# Altium schematic sheet USBgpib-v3-USBTMC.SchDoc
size Tabloid; SheetNumber: 1; SheetTotal: 1; ENG_APP_DATE: --/--/--; DSN_APP_DATE: --/--/--; CHK_APP_DATE: --/--/--
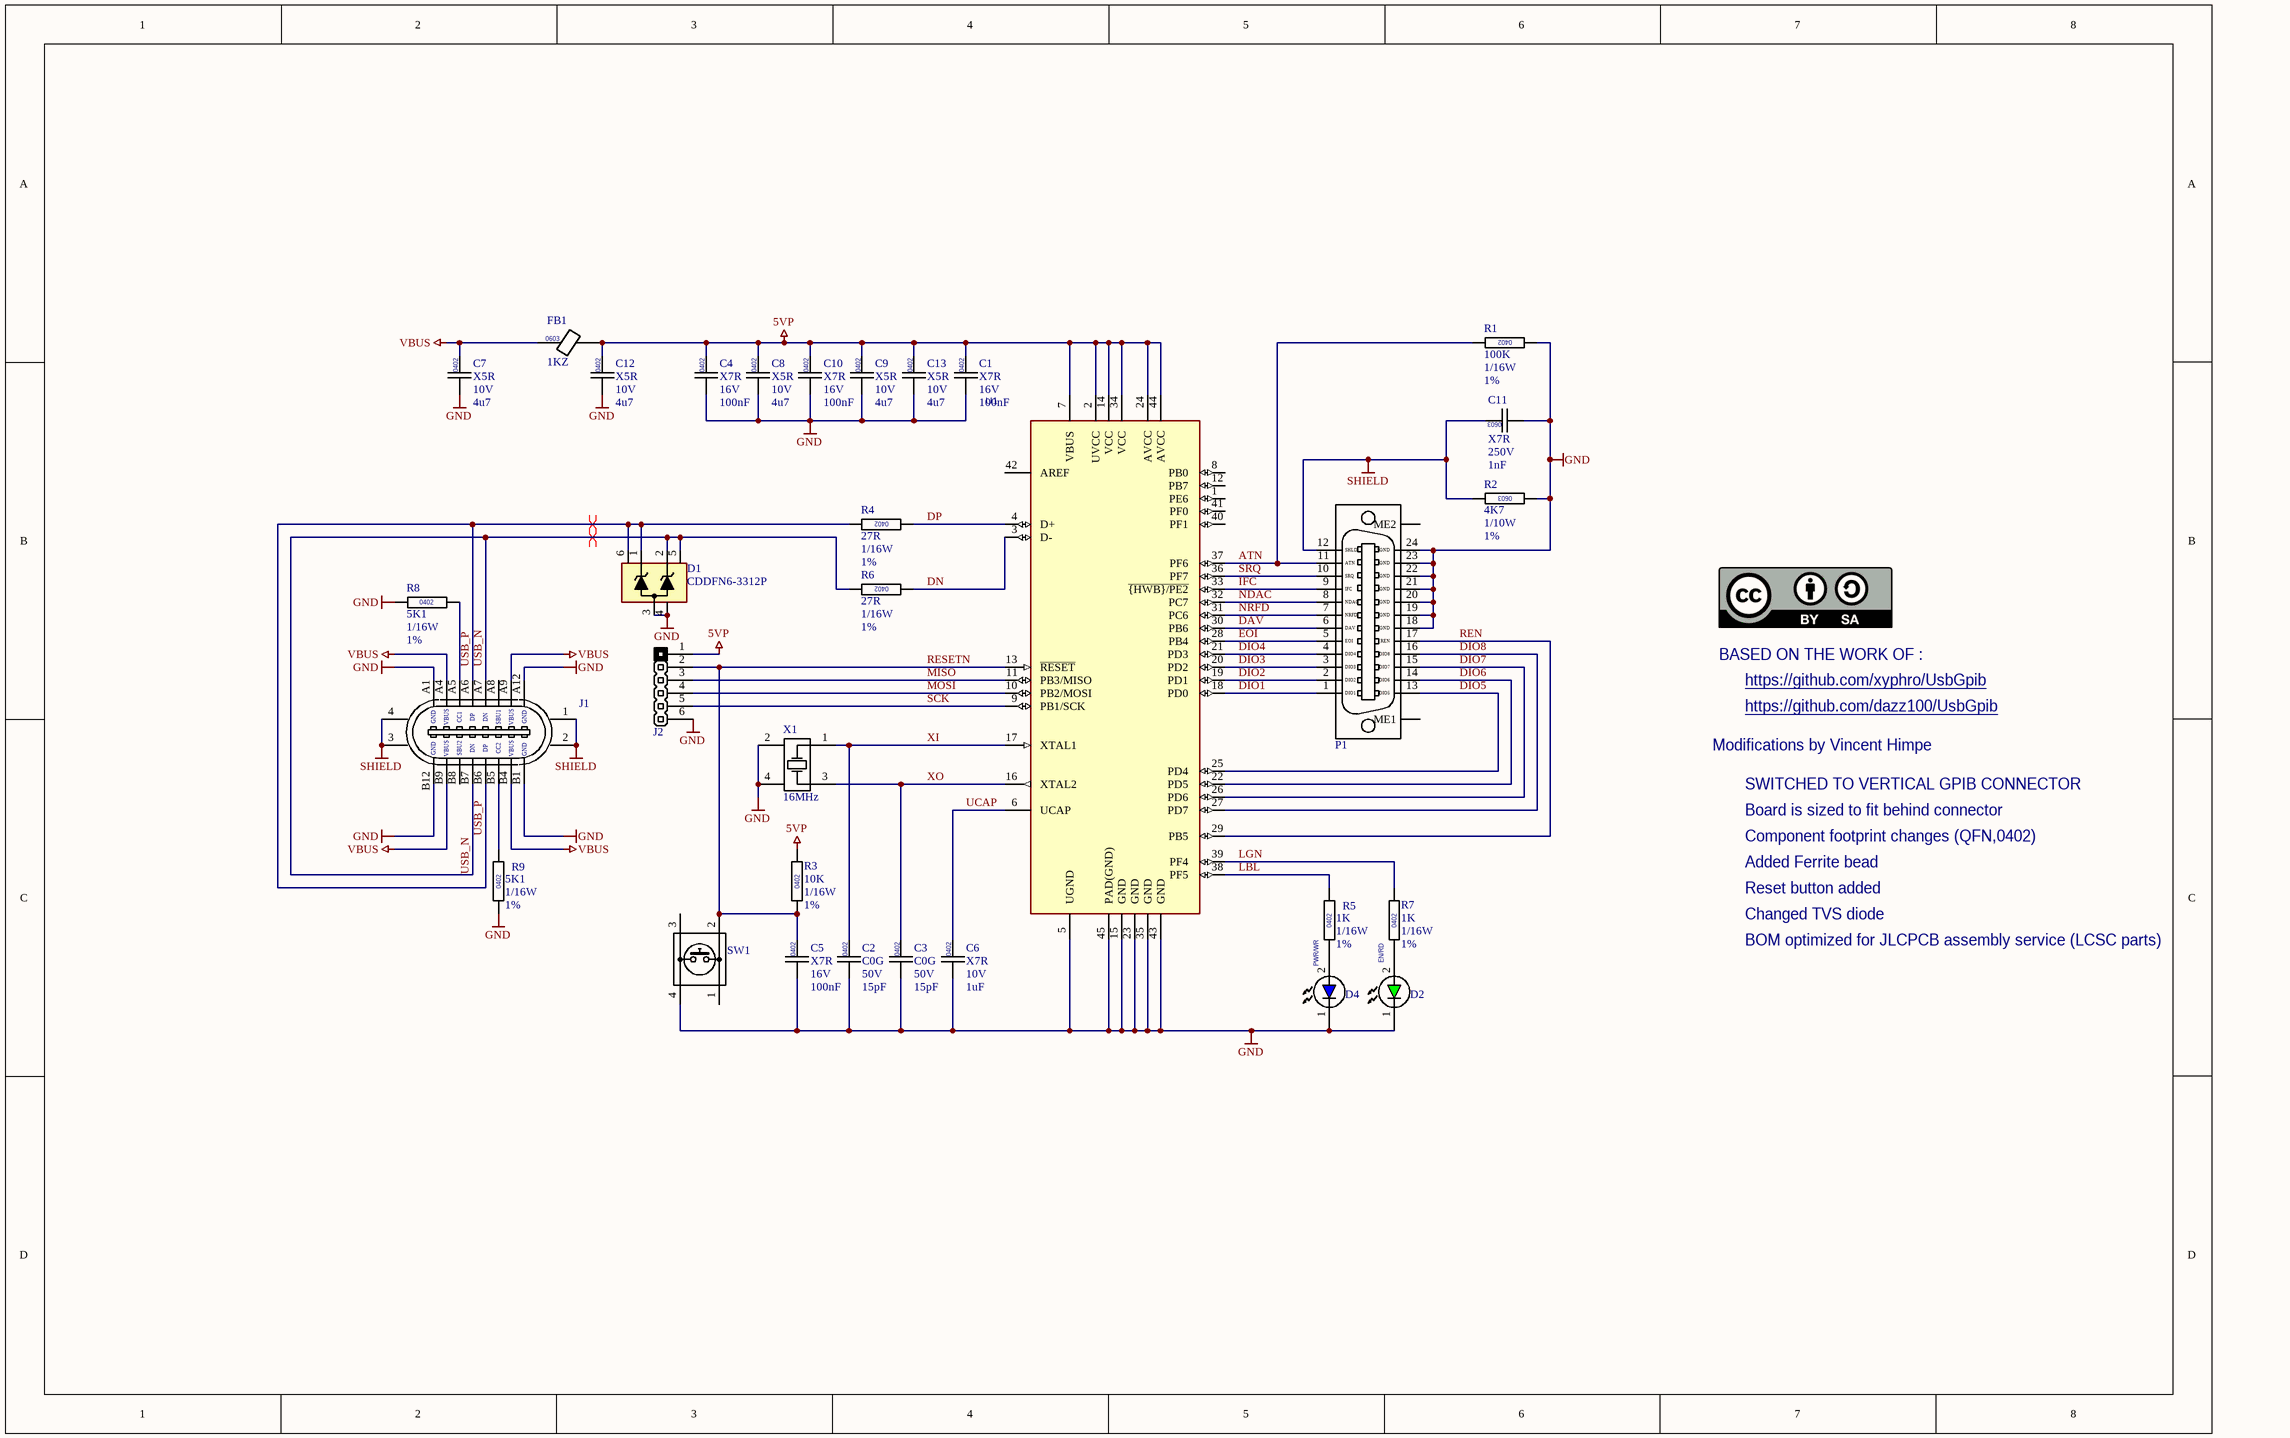
[diagram p0: USBgpib-v3-USBTMC.SchDoc]

## Parts
C1  Dielectric: X7R  Voltage: 16V  Capacitance: 100nF  [CAPC0402]  (hidden comment: CAP0402)
C2  Dielectric: C0G  Voltage: 50V  Capacitance: 15pF  [CAPC0402]  (hidden comment: CAP0603)
C3  Dielectric: C0G  Voltage: 50V  Capacitance: 15pF  [CAPC0402]  (hidden comment: CAP0603)
C4  Dielectric: X7R  Voltage: 16V  Capacitance: 100nF  [CAPC0402]  (hidden comment: CAP0402)
C5  Dielectric: X7R  Voltage: 16V  Capacitance: 100nF  [CAPC0402]  (hidden comment: CAP0402)
C6  Dielectric: X7R  Voltage: 10V  Capacitance: 1uF  [CAPC0402]  (hidden comment: CAP0402)
C7  Dielectric: X5R  Voltage: 10V  Capacitance: 4u7  [CAPC0402]  (hidden comment: CAP0402)
C8  Dielectric: X5R  Voltage: 10V  Capacitance: 4u7  [CAPC0402]  (hidden comment: CAP0402)
C9  Dielectric: X5R  Voltage: 10V  Capacitance: 4u7  [CAPC0402]  (hidden comment: CAP0402)
C10  Dielectric: X7R  Voltage: 16V  Capacitance: 100nF  [CAPC0402]  (hidden comment: CAP0402)
C11  Dielectric: X7R  Voltage: 250V  Capacitance: 1nF  [CAPC0603]  (hidden comment: CAP0603)
C12  Dielectric: X5R  Voltage: 10V  Capacitance: 4u7  [CAPC0402]  (hidden comment: CAP0402)
C13  Dielectric: X5R  Voltage: 10V  Capacitance: 4u7  [CAPC0402]  (hidden comment: CAP0402)
D1  CDDFN6-3312P  [SON40P100X50-6L]
D2  LED-PLCC2-GREEN  [LED-PLCC2-GREEN]  (value not drawn)
D4  LED-PLCC2-BLUE  [LED-PLCC2-BLUE]  (value not drawn)
FB1  value 1KZ  [FB0603]  (hidden comment: FB0603)
J1  CONN-USBC-USB2-VERT  [CONN-CUI-UJ20-C-V-C-3-SMT-TR]  (value not drawn)
J2  CONN-HEADER-PIN-1X6  [HEADER-1X6]  (value not drawn)
P1  CONN-NORCOMP-111-024-113R00  [CONN-NORCOMP-111-024-113L001]  (value not drawn)
R1  value 100K  Power: 1/16W  Tolerance: 1%  [RESC0402]  (hidden comment: RESC0402)
R2  value 4K7  Power: 1/10W  Tolerance: 1%  [RESC0603]  (hidden comment: RESC0603)
R3  value 10K  Power: 1/16W  Tolerance: 1%  [RESC0402]  (hidden comment: RESC0402)
R4  value 27R  Power: 1/16W  Tolerance: 1%  [RESC0402]  (hidden comment: RESC0402)
R5  value 1K  Power: 1/16W  Tolerance: 1%  [RESC0402]  (hidden comment: RESC0402)
R6  value 27R  Power: 1/16W  Tolerance: 1%  [RESC0402]  (hidden comment: RESC0402)
R7  value 1K  Power: 1/16W  Tolerance: 1%  [RESC0402]  (hidden comment: RESC0402)
R8  value 5K1  Power: 1/16W  Tolerance: 1%  [RESC0402]  (hidden comment: RESC0402)
R9  value 5K1  Power: 1/16W  Tolerance: 1%  [RESC0402]  (hidden comment: RESC0402)
SW1  SWITCH-PANASONIC-EVP-AA202K  [SWITCH-PANASONIC-EVP-AA202K]  (value not drawn)
U1  ATMEGA32U4-MUR  [QFN50P700X700X-44-TH520X520]  (value not drawn)
X1  16MHz  [XOSC-YXC-2016]

## Nets
5VP: C1.1 C4.1 C8.1 C9.1 C10.1 C12.1 C13.1 FB1.2 J2.1(+) R3.1 U1.2(UVCC) U1.7(VBUS) U1.14(VCC) U1.24(AVCC) U1.34(VCC) U1.44(AVCC)
GND: C1.2 C2.2 C3.2 C4.2 C5.2 C6.2 C7.2 C8.2 C9.2 C10.2 C11.2 C12.2 C13.2 D1.3(A) D1.4(A) D2.1(A) D4.1(A) J1.A1 J1.A12 J1.B1 J1.B12 J2.6(+) P1.18(GND) P1.19(GND) P1.20(GND) P1.21(GND) P1.22(GND) P1.23(GND) P1.24(SGND) R1.2 R2.2 R8.2 R9.2 SW1.4 U1.5(UGND) U1.15(GND) U1.23(GND) U1.35(GND) U1.43(GND) U1.45(PAD(GND)) X1.2(GND) X1.4(GND)
SHIELD: C11.1 J1.1 J1.2 J1.3 J1.4 P1.12(SHLD) R2.1
VBUS: C7.1 FB1.1 J1.A4 J1.A9 J1.B4 J1.B9
ATN: P1.11(ATN) R1.1 U1.37(PF6)
DAV: P1.6(DAV) U1.30(PB6)
DIO1: P1.1(DIO1) U1.18(PD0)
DIO2: P1.2(DIO2) U1.19(PD1)
DIO3: P1.3(DIO3) U1.20(PD2)
DIO4: P1.4(DIO4) U1.21(PD3)
DIO5: P1.13(DIO5) U1.25(PD4)
DIO6: P1.14(DIO6) U1.22(PD5)
DIO7: P1.15(DIO7) U1.26(PD6)
DIO8: P1.16(DIO8) U1.27(PD7)
DN: R6.2 U1.3(D-)
DP: R4.2 U1.4(D+)
EOI: P1.5(EOI) U1.28(PB4)
IFC: P1.9(IFC) U1.33(~{{HWB}/PE2})
LBL: R5.1 U1.38(PF5)
LGN: R7.1 U1.39(PF4)
MISO: J2.3(+) U1.11(PB3/MISO)
MOSI: J2.4(+) U1.10(PB2/MOSI)
NDAC: P1.8(NDAC) U1.32(PC7)
NRFD: P1.7(NRFD) U1.31(PC6)
REN: P1.17(REN) U1.29(PB5)
RESETN: C5.1 J2.2(+) R3.2 SW1.2 U1.13(~{RESET})
SCK: J2.5(+) U1.9(PB1/SCK)
SRQ: P1.10(SRQ) U1.36(PF7)
UCAP: C6.1 U1.6(UCAP)
USB_N: D1.2(A) D1.5(A) J1.A7 J1.B7 R6.1
USB_P: D1.1(K) D1.6(A) J1.A6 J1.B6 R4.1
XI: C2.1 U1.17(XTAL1) X1.1(OSC1)
XO: C3.1 U1.16(XTAL2) X1.3(OSC2)
NetD2_2: D2.2(K) R7.2
NetD4_2: D4.2(K) R5.2
NetJ1_A5: J1.A5 R8.1
NetJ1_B5: J1.B5 R9.1

Not connected (* = marked no-connect by the designer): J1 A8 B8; P1 ME1 ME2; SW1 1 3; U1 1(PE6) 8(PB0) 12(PB7) 40(PF1) 41(PF0) 42(AREF)

## Layout directives
differential pair; differential pair class USB: USB_N, USB_P

## Notes on the sheet
- BASED ON THE WORK OF :
- https://github.com/xyphro/UsbGpib
- https://github.com/dazz100/UsbGpib
- Modifications by Vincent Himpe
- SWITCHED TO VERTICAL GPIB CONNECTOR
- Board is sized to fit behind connector
- Component footprint changes (QFN,0402)
- Added Ferrite bead
- Reset button added
- Changed TVS diode
- BOM optimized for JLCPCB assembly service (LCSC parts)
- (near R5) PWR/WR
- (near R7) EN/RD
- DWG. NO.
- REV.
- SHT.
- THIS DOCUMENT AND THE DATA DISCLOSED HEREIN OR HEREWITH IS THE PROPERTY OF ALTIUM LIMITED AND MAY BE FREELY DISTRIBUTED IN WHOLE. NO RIGHTS ARE RESERVED OR EXPRESS OR IMPLIED WARANTEE GIVEN.
- REVISION
- DESCRIPTION
- DATE
- APPROVED
- ENG:
- APPROVALS
- PROJECT
- DSN:
- CHK:
- REFERENCE DOCUMENTS
- PROJECT REVISION:
- TITLE
- DOCUMENT REVISION:
- DESIGN ITEM:
- BOM:
- FAB DWG:
- PCB DWG:
- ASSY DWG:
- SCALE:
- SIZE
- B
- CAGE CODE
- FILE NAME
- DWG NO.
- SHEET
- OF
- REV
- (in symbol CAPC-0402-1u-10V-X7R) 0402
- (in symbol CONN-USBC-USB2-VERT) GND; VBUS; CC1; DP; DN; SBU1; SBU2; CC2
- (in symbol FB0603-1KZ-0R2) 0603
- (in symbol RESC-0402-1K-1%-1/10W) 0402
- (in symbol RESC-0402-5K1-1%-1/10W) 0402
- (in symbol RESC-0402-10K-1%-1/10W) 0402
- (in symbol RESC-0402-27R-1%-1/10W) 0402
- (in symbol RESC-0402-100K-1%-1/10W) 0402
- (in symbol RESC-0603-4K7-1%-1/10W) 0603

## Library data of the parts
C1 C4 C5 C10 = CAPC-0402-100nF-16V-X7R: CAPACITOR,CERAMIC,100nF,16V,X7R,0402; Package / Case: 0402; Location: *; Supplier 1: Digikey; Supplier Part Number 1: 1292-1630-1-ND; LCSC: C60474
C2 C3 = CAPC-0402-15PF-50V-C0G: CAPACITOR,CERAMIC,15pF,50V,C0G,0402; Package / Case: 0402; Location: *; LCSC: C3906764; Supplier 1: Digikey; Supplier Part Number 1: 311-3780-1-ND
C6 = CAPC-0402-1u-10V-X7R: CAPACITOR,CERAMIC,1uF,10V,X7R,0402; Package / Case: 0603; Location: *; LCSC: C528974; Supplier 1: Mouser; Supplier Part Number 1: 81-GRM155Z71A105KE1D
C7-C9 C12 C13 = CAPC-0402-4u7-10V-X5R: CAPACITOR,CERAMIC,4u7,10V,X5R,0402; Package / Case: 0402; Location: *; Supplier 1: Digikey; Supplier Part Number 1: 1276-1482-1-ND; LCSC: C23733
C11 = CAPC-0603-1nF-250V-X7R: CAPACITOR,CERAMIC,1nF,250V,X7R,0603; Package / Case: 0603; Location: *; LCSC: C277510; Supplier 1: Digikey; Supplier Part Number 1: 311-4104-1-ND
D1 = TVS-BOURNS-CDDFN6-3312P: TVS,USB,BOURNS,CDDFN6-3312P; LCSC: C3700524
D2 = LED-PLCC2-GREEN: LED,GREEN,PLCC2; LCSC: C5248446; Supplier 1: Digikey; Supplier Part Number 1: 475-LGT67K-H2K1-24-ZCT-ND
D4 = LED-PLCC2-BLUE: LED,BLUE,PLCC2; LCSC: C6323026; Supplier 1: Mouser; Supplier Part Number 1: 78-VLMB41P1Q2-GS18
FB1 = FB0603-1KZ-0R2: FERRITE,1KZ@100MHz,0R2DC,0603; LCSC: C160982; Supplier 1: Arrow Electronics; Supplier Part Number 1: BLM18KG102SN1D
J1 = CONN-USBC-USB2-VERT: CONN,USB-C,VERTICAL,TH
J2 = CONN-HEADER-PIN-1X6: CONN,PINHEADER,1X6,2.45MM,VERT,GOLD
P1 = CONN-NORCOMP-111-024-113R00: CONN,GPIB,24P,VERT,TH; Supplier 1: Digikey; Supplier Part Number 1: 1024RMA-ND
R1 = RESC-0402-100K-1%-1/10W: RESISTOR,100K,1%,63mW,0402 (1005); Location: *; LCSC: C60491; Supplier 1: Future Electronics; Supplier Part Number 1: 3068008
R2 = RESC-0603-4K7-1%-1/10W: RESISTOR,4K7,1%,100mW,0603 (1608); Location: *; Supplier 1: Future Electronics; Supplier Part Number 1: 5489695; Supplier 2: Digikey; Supplier Part Number 2: P4.70KHCT-ND; Supplier 3: Digikey; Supplier Part Number 3: RMCF0603FT4K70CT-ND; Supplier 4: Avnet; Supplier Part Number 4: 1622960-1; LCSC: C99782
R3 = RESC-0402-10K-1%-1/10W: RESISTOR,10K,1%,63mW,0402 (1005); Location: *; LCSC: C60490; Supplier 1: Future Electronics; Supplier Part Number 1: 3388022
R4 R6 = RESC-0402-27R-1%-1/10W: RESISTOR,27R,1%,63mW,0402 (1005); Location: *; Supplier 1: Future Electronics; Supplier Part Number 1: 2577120; LCSC: C138021
R5 R7 = RESC-0402-1K-1%-1/10W: RESISTOR,1K,1%,63mW,0402 (1005); Location: *; LCSC: C106235; Supplier 1: Future Electronics; Supplier Part Number 1: 7825607
R8 R9 = RESC-0402-5K1-1%-1/10W: RESISTOR,5K1,1%,63mW,0402 (1005); Location: *; LCSC: C105872; Supplier 1: Future Electronics; Supplier Part Number 1: 6053649
SW1 = SWITCH-PANASONIC-EVP-AA202K: SW,SMD,TACT,4PIN,2.9X3.5,4PIN; Supplier 1: Mouser; Supplier Part Number 1: 667-EVP-AA202K; LCSC: C483888
U1 = IC-ATMEL-ATMEGA32U4-QFN: IC,CPU,ATMEG32U4-MU,QFN44; Footprint: Package_QFP:TQFP-44_10x10mm_P0.8mm; LCSC: C45874
X1 = XTAL-YXC-XL7EL89COI-111YLC-16M: XTAL,16MHz,2016,4P; LCSC: C2965579; Frequency: 16MHz